# Altium schematic sheet 1_Main copy.schdoc
size 497 x 243 mm; Name: A_A4; Symbol: A_A4; Device: A_A4; @Project Name: TUD-EnergyHarvestingConsole_2022-08-29_17-01-09; REV: 1.0; Date: 2022-08-11; Sheet: 1/1; Draw By: Alejandro Cabrerizo; Convert to PCB: yes; Add into BOM: yes
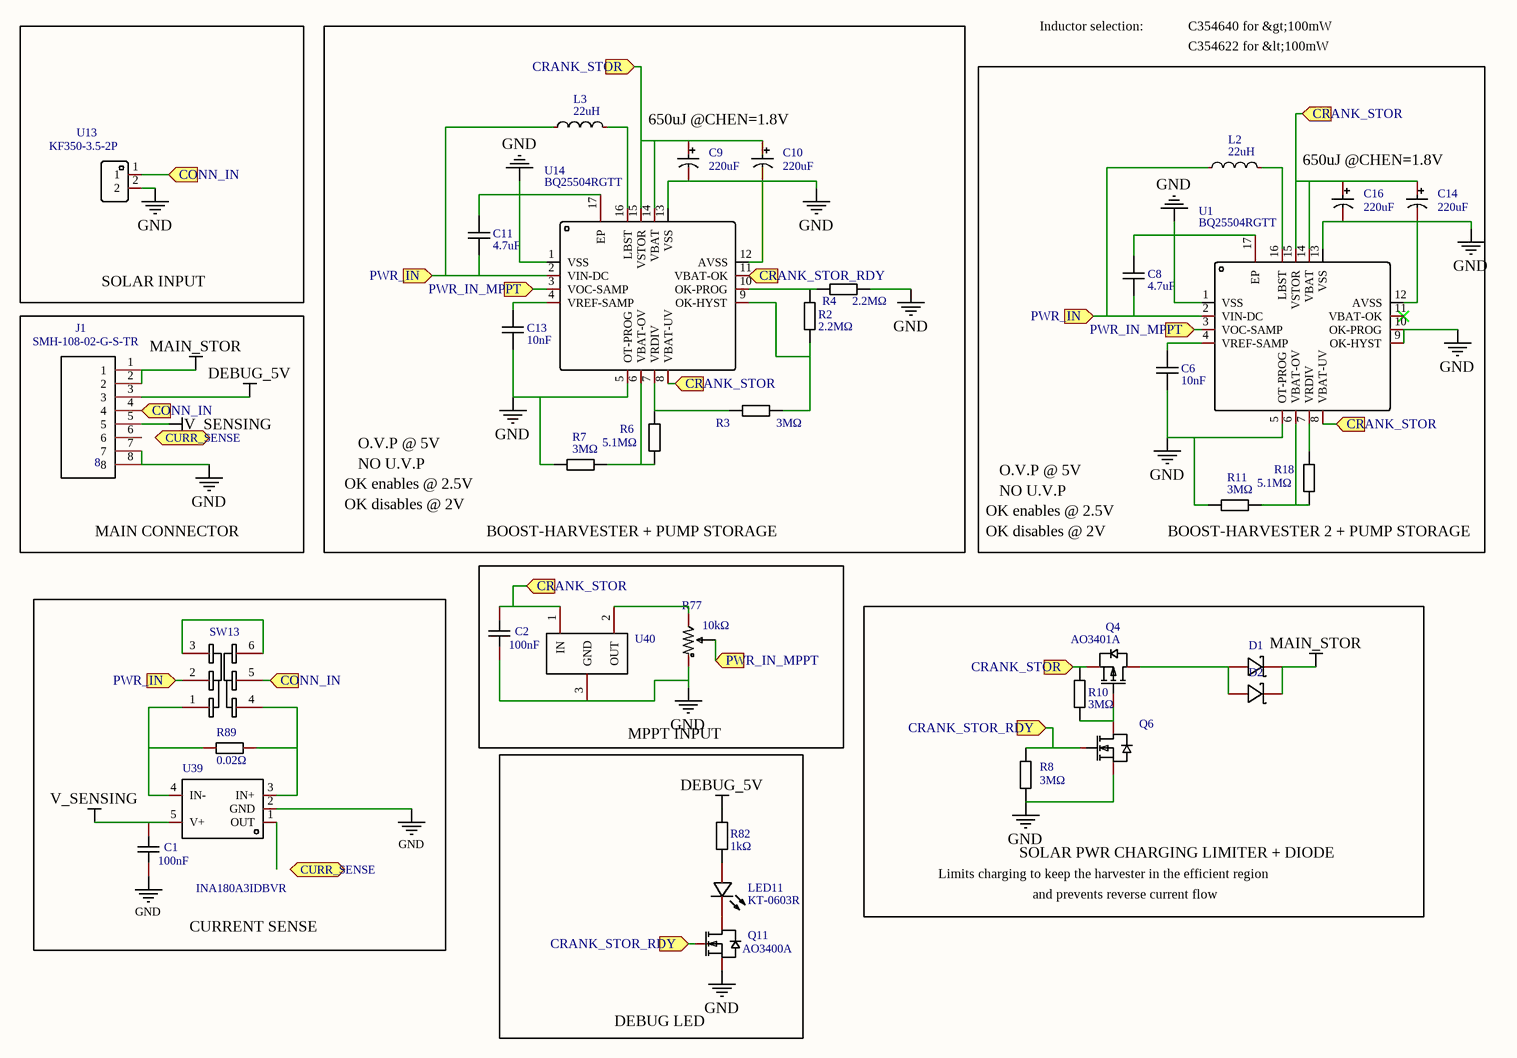
[diagram p0: 1_Main copy.schdoc]

## Parts
C1  100nF  [C0603]
C2  100nF  [C0603]
C6  10nF  [C0603]
C8  4.7uF  [C0603]
C9  220uF  [CAP-SMD_BD6.3-L6.6-W6.6-LS7.2-R-RD]
C10  220uF  [CAP-SMD_BD6.3-L6.6-W6.6-LS7.2-R-RD]
C11  4.7uF  [C0603]
C13  10nF  [C0603]
C14  220uF  [CAP-SMD_BD6.3-L6.6-W6.6-LS7.2-R-RD]
C16  220uF  [CAP-SMD_BD6.3-L6.6-W6.6-LS7.2-R-RD]
D1  SS54  [SMA_L4.4-W2.8-LS5.4-R-RD]  (value not drawn)
D2  SS54  [SMA_L4.4-W2.8-LS5.4-R-RD]  (value not drawn)
J1  NAME: 8  [SMH-108-02-XX-S-TR]  (hidden comment: SMH-108-02-G-S-TR)
L2  22uH  [IND-SMD_L6.0-W6.0]
L3  22uH  [IND-SMD_L6.0-W6.0]
LED11  KT-0603R  [LED0603-R-RD]
Q4  AO3401A  [SOT-23_L2.9-W1.3-P1.90-LS2.4-BR]
Q6  SI2302  [SOT-23-3_L2.9-W1.3-P1.90-LS2.4-BR]  (value not drawn)
Q11  AO3400A  [SOT-23-3_L2.9-W1.3-P1.90-LS2.4-BR]
R2  2.2MΩ  [R0603]
R3  3MΩ  [R0603]
R4  2.2MΩ  [R0603]
R6  5.1MΩ  [R0603]
R7  3MΩ  [R0603]
R8  3MΩ  [R0603]
R10  3MΩ  [R0603]
R11  3MΩ  [R0603]
R18  5.1MΩ  [R0603]
R77  value 10kΩ  [RES-ADJ-TH_3362P]  (hidden comment: 3362P-1-103)
R82  1kΩ  [R0603]
R89  value 0.02Ω  [R0805]  (hidden comment: RL0805FR-070R02L)
SW13  K3-2235D-F1  [SW-TH_K3-2235D-F1]  (value not drawn)
U1  BQ25504RGTT  [VQFN-16_L3.0-W3.0-P0.50-TL-EP]
U13  KF350-3.5-2P  [CONN-TH_P3.50_KF350-3.5-2P]
U14  BQ25504RGTT  [VQFN-16_L3.0-W3.0-P0.50-TL-EP]
U39  INA180A3IDBVR  [SOT-23-5_L3.0-W1.7-P0.95-LS2.8-BR]
U40  REF3318AIDBZT  [SOT-23-3_L2.9-W1.3-P1.90-LS2.4-BR]  (value not drawn)

## Blocks framed on the sheet
SOLAR INPUT: U13
MAIN CONNECTOR: J1
CURRENT SENSE: C1 R89 SW13 U39
MPPT INPUT: C2 R77 U40
SOLAR PWR CHARGING LIMITER + DIODE: D1 D2 Q4 Q6 R8 R10
DEBUG LED: LED11 Q11 R82

## Ports
CONN_IN (in), CRANK_STOR (in), CRANK_STOR_RDY (in), CURR_SENSE (bidir), PWR_IN (in), PWR_IN_MPPT (in)

## Nets
DEBUG_5V: J1.3 R82.2
GND: C1.1 C2.1 C6.1 C8.2 C9.2 C10.2 C11.2 C13.1 C14.2 C16.2 J1.7 J1.8 Q6.2(S) Q11.2(S) R4.2 R7.1 R8.2 R11.1 R77.1 U1.1(VSS) U1.5(OT-PROG) U1.9(OK-HYST) U1.10(OK-PROG) U1.12(AVSS) U1.13(VSS) U1.17(EP) U13.2 U14.1(VSS) U14.5(OT-PROG) U14.12(AVSS) U14.13(VSS) U14.17(EP) U39.2(GND) U40.3(GND)
MAIN_STOR: D1.2(K) D2.2(K) J1.1 J1.2
V_SENSING: C1.2 J1.5 U39.5(V+)
CONN_IN: J1.4 SW13.5 U13.1 ; port CONN_IN
CRANK_STOR: C2.2 C9.1 C10.1 C14.1 C16.1 Q4.2(S) R10.2 U1.8(VBAT-UV) U1.14(VBAT) U1.15(VSTOR) U14.8(VBAT-UV) U14.14(VBAT) U14.15(VSTOR) U40.1(IN) ; port CRANK_STOR
CRANK_STOR_RDY: Q6.1(G) Q11.1(G) R8.1 U14.11(VBAT-OK) ; port CRANK_STOR_RDY
PWR_IN: C8.1 C11.1 L2.1 L3.1 SW13.2 U1.2(VIN-DC) U14.2(VIN-DC) ; port PWR_IN
PWR_IN_MPPT: R77.2 U1.3(VOC-SAMP) U14.3(VOC-SAMP) ; port PWR_IN_MPPT
NetC6_2: C6.2 U1.4(VREF-SAMP)
NetC13_2: C13.2 U14.4(VREF-SAMP)
NetD1_1: D1.1(A) D2.1(A) Q4.3(D)
NetL2_2: L2.2 U1.16(LBST)
NetL3_2: L3.2 U14.16(LBST)
NetLED11_1: LED11.1(A) R82.1
NetLED11_2: LED11.2(K) Q11.3(D)
NetQ4_1: Q4.1(G) Q6.3(D) R10.1
NetR2_1: R2.1 R3.1 U14.9(OK-HYST)
NetR2_2: R2.2 R4.1 U14.10(OK-PROG)
NetR3_2: R3.2 R6.1 U14.7(VRDIV)
NetR6_2: R6.2 R7.2 U14.6(VBAT-OV)
NetR11_2: R11.2 R18.2 U1.6(VBAT-OV)
NetR18_1: R18.1 U1.7(VRDIV)
NetR77_3: R77.3 U40.2(OUT)
NetR89_1: R89.1 SW13.1 U39.4(IN-)
NetR89_2: R89.2 SW13.4 U39.3(IN+)
NetSW13_3: SW13.3 SW13.6

Not connected (* = marked no-connect by the designer): J1 6; U1 11(VBAT-OK)*; U39 1(OUT)

## Notes on the sheet
- Inductor selection:
- C354622 for &lt;100mW
- C354640 for &gt;100mW
- 650uJ @CHEN=1.8V
- O.V.P @ 5V
- OK disables @ 2V
- OK enables @ 2.5V
- NO U.V.P
- BOOST-HARVESTER + PUMP STORAGE
- (near R11) BOOST-HARVESTER 2 + PUMP STORAGE
- Limits charging to keep the harvester in the efficient region
- and prevents reverse current flow
- 1
- 2
- 3
- 4
- 5
- A
- B
- C
- D
- TITLE:
- TUD-EnergyHarvestingConsole_2022-08-29_17-01-09
- REV:
- 1.0
- Date:
- Company:
- 2022-08-11
- Drawn By:
- Alejandro Cabrerizo
- Sheet:
- 1/1

## Library data of the parts
C1 C2 = CC0603KRX7R9BB104: Manufacturer: YAGEO; Convert to PCB: yes; NAME: 2; Name: 100nF; Symbol: 100nF; Device: CC0603KRX7R9BB104; Supplier: LCSC; Manufacturer Part: CC0603KRX7R9BB104; Supplier Part: C14663; JLCPCB Part Class: Basic; Add into BOM: yes; Origin Footprint: C0603; NUMBER: 2
C6 C13 = 0603B103K500NT: Manufacturer: FH; Convert to PCB: yes; Name: 10nF; Symbol: 10nF; Device: 0603B103K500NT; Supplier: LCSC; Manufacturer Part: 0603B103K500NT; Supplier Part: C57112; JLCPCB Part Class: Basic Part; Add into BOM: yes; Origin Footprint: C0603
C8 C11 = CL10A475KO8NNNC: Manufacturer: SAMSUNG; Convert to PCB: yes; Name: 4.7uF; Symbol: 4.7uF; Device: CL10A475KO8NNNC; Supplier: LCSC; Manufacturer Part: CL10A475KO8NNNC; Supplier Part: C19666; JLCPCB Part Class: Basic Part; Add into BOM: yes; Origin Footprint: C0603
C9 C10 C14 C16 = RVT1A221M0605: Manufacturer: HONOR; Convert to PCB: yes; Name: 220uF; Symbol: 220uF; Device: RVT1A221M0605; Supplier: LCSC; Manufacturer Part: RVT1A221M0605; Supplier Part: C3345; JLCPCB Part Class: Extended Part; Add into BOM: yes; Origin Footprint: CAP-SMD_BD6.3-L6.6-W6.6-LS7.2-R-RD
D1 D2 = SS54: Reverse Voltage (Vr):40V Average Rectified Current (Io):5A Forward Voltage (Vf@If):550mV@5A; Manufacturer: MDD; Symbol: SS54_C22452; Add into BOM: yes; Reverse Voltage (Vr): 40V; Average Rectified Current (Io): 5A; Device: SS54; LCSC Part Name: 40V 5A 550mV@5A; Supplier Part: C22452; Manufacturer Part: SS54; Supplier Footprint: SMA(DO-214AC); JLCPCB Part Class: Basic Part; Datasheet: https://atta.szlcsc.com/upload/public/pdf/source/20190306/C22452_DC5E4F74C3B638F6D8E4C7650D5BF30E.pdf; Supplier: LCSC; Convert to PCB: yes; Forward Voltage (Vf@If): 550mV@5A
J1 = SMH-108-02-G-S-TR: Convert to PCB: yes; Name: SMH-108-02-G-S-TR; Symbol: SMH-108-02-G-S-TR; Device: SMH-108-02-G-S-TR; Add into BOM: yes; Origin Footprint: SMH-108-02-XX-S-TR
L2 L3 = CKCS6028-22uH/M: Manufacturer: CENKER; Convert to PCB: yes; Name: 22uH; Symbol: 22uH; Device: CKCS6028-22uH/M; Supplier: LCSC; Supplier Part: C354622; Manufacturer Part: CKCS6028-22uH/M; JLCPCB Part Class: Extended Part; Add into BOM: yes; Origin Footprint: IND-SMD_L6.0-W6.0
LED11 = KT-0603R: Manufacturer: KENTO; Convert to PCB: yes; Name: KT-0603R; Symbol: KT-0603R; Device: KT-0603R; Supplier: LCSC; Manufacturer Part: KT-0603R; Supplier Part: C2286; JLCPCB Part Class: Basic Part; Add into BOM: yes; Origin Footprint: LED0603-R-RD
Q4 = AO3401A: Manufacturer: AOS; Convert to PCB: yes; Name: AO3401A; Symbol: AO3401A; Device: AO3401A; Supplier: LCSC; Manufacturer Part: AO3401A; Supplier Part: C15127; JLCPCB Part Class: Basic Part; Add into BOM: yes; Origin Footprint: SOT-23_L2.9-W1.3-P1.90-LS2.4-BR
Q6 = SI2302: Manufacturer: YONGYUTAI(永裕泰); Symbol: SI2302_C2891732; Add into BOM: yes; Device: SI2302; LCSC Part Name: SI2302; Supplier Part: C2891732; Manufacturer Part: SI2302; Supplier Footprint: SOT-23; JLCPCB Part Class: Extended Part; Datasheet: https://atta.szlcsc.com/upload/public/pdf/source/20210901/467BBA277A18343FF82D7D641AA41F7C.pdf; Supplier: LCSC; Convert to PCB: yes
Q11 = AO3400A: Manufacturer: HUASHUO(华朔); Convert to PCB: yes; NUMBER: 3; Name: AO3400A; Symbol: AO3400A; Device: AO3400A; Supplier: LCSC; Supplier Part: C700953; Manufacturer Part: AO3400A; JLCPCB Part Class: Extended Part; Add into BOM: yes; Origin Footprint: SOT-23-3_L2.9-W1.3-P1.90-LS2.4-BR
R2 R4 = 0603WAF2204T5E: Manufacturer: UniOhm; Resistance: 2.2M; Convert to PCB: yes; Name: 2.2MΩ; Symbol: 2.2MΩ; Device: 0603WAF2204T5E; Supplier: LCSC; Manufacturer Part: 0603WAF2204T5E; Supplier Part: C22938; JLCPCB Part Class: Basic Part; Add into BOM: yes; Origin Footprint: R0603
R3 R7 R8 R10 R11 = 0603WAF3004T5E: Manufacturer: UniOhm; Resistance: 3M; Convert to PCB: yes; Name: 3MΩ; Symbol: 3MΩ; Device: 0603WAF3004T5E; Supplier: LCSC; Manufacturer Part: 0603WAF3004T5E; Supplier Part: C23156; JLCPCB Part Class: Basic Part; Add into BOM: yes; Origin Footprint: R0603
R6 R18 = 0603WAF5104T5E: Manufacturer: UniOhm; Resistance: 5.1M; Convert to PCB: yes; Name: 5.1MΩ; Symbol: 5.1MΩ; Device: 0603WAF5104T5E; Supplier: LCSC; Manufacturer Part: 0603WAF5104T5E; Supplier Part: C13320; JLCPCB Part Class: Basic Part; Add into BOM: yes; Origin Footprint: R0603
R77 = 3362P-1-103: Resistance:10kΩ Tolerance:±10% Temperature Coefficient:±250ppm/ Temperature Coefficient:±250ppm/; Manufacturer: BOCHEN(博晨); Symbol: 3362P-1-103_C118956; Add into BOM: yes; Tolerance: ±10%; Device: 3362P-1-103; LCSC Part Name: 10kΩ ±10%; Supplier Part: C118956; Manufacturer Part: 3362P-1-103; Supplier Footprint: 插件; JLCPCB Part Class: Extended Part; Datasheet: https://atta.szlcsc.com/upload/public/pdf/source/20171114/C118956_15106326650691117445.pdf; Supplier: LCSC; Convert to PCB: yes; Temperature Coefficient: ±250ppm/
R82 = 0603WAF1001T5E: Manufacturer: UniOhm; Resistance: 1K; Convert to PCB: yes; Name: 1kΩ; Symbol: 1kΩ; Device: 0603WAF1001T5E; Supplier: LCSC; Manufacturer Part: 0603WAF1001T5E; Supplier Part: C21190; JLCPCB Part Class: Basic Part; Add into BOM: yes; Origin Footprint: R0603
R89 = RL0805FR-070R02L: Tolerance:±1% Temperature Coefficient:±1200ppm/ Temperature Coefficient:±1200ppm/ Resistance:0.02Ω Power(Watts):125mW; Manufacturer: YAGEO(国巨); Add into BOM: yes; Tolerance: ±1%; Power(Watts): 125mW; Symbol: RL0805FR-070R02L; Device: RL0805FR-070R02L; LCSC Part Name: 0.02Ω(0R02) ±1%; Supplier Part: C326964; Manufacturer Part: RL0805FR-070R02L; Supplier Footprint: 0805; JLCPCB Part Class: Extended Part; Datasheet: https://atta.szlcsc.com/upload/public/pdf/source/20181031/C326964_D4F5766875A1FEE89F9BFCE15D0C04AE.pdf; Supplier: LCSC; Convert to PCB: yes; Temperature Coefficient: ±1200ppm/
SW13 = K3-2235D-F1: Current Rating (DC):300mA Voltage Rating (DC):6V Current Rating (AC):- Voltage Rating (AC):- Circuit:双刀双掷 Mounting Style:直插 Mechanical Life:10000 Actuator Color:黑色 Actuator Style:矩形柱状 Pin Style:PC引脚 Operating Temperature:-25~+80 Operating Temperature:-2; Manufacturer: 韩国韩荣; Add into BOM: yes; Current Rating (DC): 300mA; Voltage Rating (DC): 6V; Circuit: 双刀双掷; Mechanical Life: 10000; Actuator Color: 黑色; Actuator Style: 矩形柱状; Pin Style: PC引脚; Switch Length: 9mm; Switch Width: 3.5mm; Symbol: K3-2235D-F1; Device: K3-2235D-F1; LCSC Part Name: K3-2235D-F1; Supplier Part: C189615; Manufacturer Part: K3-2235D-F1; Supplier Footprint: 插件; JLCPCB Part Class: Extended Part; Datasheet: https://atta.szlcsc.com/upload/public/pdf/source/20210810/9F56F04DF7CBA8FC4D1B091DF1444945.pdf; Supplier: LCSC; Convert to PCB: yes; Current Rating (AC): -; Voltage Rating (AC): -; Mounting Style: 直插; Operating Temperature: -25~+80; Switch Height: 3.5mm
U1 U14 = BQ25504RGTT: Manufacturer: Texas Instruments; Convert to PCB: yes; Name: BQ25504RGTT; Symbol: BQ25504RGTT; Device: BQ25504RGTT; Supplier: LCSC; Supplier Part: C157471; Manufacturer Part: BQ25504RGTT; JLCPCB Part Class: Extended Part; Add into BOM: yes; Origin Footprint: VQFN-16_L3.0-W3.0-P0.50-TL-EP
U13 = KF350-3.5-2P: Manufacturer: Cixi Kefa Elec; Convert to PCB: yes; Name: KF350-3.5-2P; Symbol: KF350-3.5-2P; Device: KF350-3.5-2P; Supplier: LCSC; Supplier Part: C474892; Manufacturer Part: KF350-3.5-2P; JLCPCB Part Class: Extended Part; Add into BOM: yes; Origin Footprint: CONN-TH_P3.50_KF350-3.5-2P
U39 = INA180A3IDBVR: Manufacturer: TI(德州仪器); Add into BOM: yes; Symbol: INA180A3IDBVR; Device: INA180A3IDBVR; LCSC Part Name: INA180A3IDBVR; Supplier Part: C122882; Manufacturer Part: INA180A3IDBVR; Supplier Footprint: SOT-23-5; JLCPCB Part Class: Extended Part; Datasheet: https://atta.szlcsc.com/upload/public/pdf/source/20171014/C122882_15079752744071037935.pdf; Supplier: LCSC; Convert to PCB: yes
U40 = REF3318AIDBZT: Output Type:固定 Input Voltage:2V~5.5V Input Voltage:2V~5.5V Output Voltage:1.8V Output Voltage:1.8V Output Current:5mA Tolerance:±0.15% Tolerance:±0.15% Temperature Coefficient:30ppm/ Operating Temperature:-40~+125@(TA) Operating Temperature:-40~+125@; Manufacturer: TI(德州仪器); Add into BOM: yes; Output Type: 固定; Output Voltage: 1.8V; Output Current: 5mA; Tolerance: ±0.15%; Temperature Coefficient: 30ppm/; Symbol: REF3318AIDBZT; Device: REF3318AIDBZT; LCSC Part Name: 1.8V 5mA; Supplier Part: C133999; Manufacturer Part: REF3318AIDBZT; Supplier Footprint: SOT-23(SOT-23-3); JLCPCB Part Class: Extended Part; Datasheet: https://atta.szlcsc.com/upload/public/pdf/source/20171014/C133999_15079755784141038320.pdf; Supplier: LCSC; Convert to PCB: yes; Input Voltage: 2V~5.5V; Operating Temperature: -40~+125@(TA)